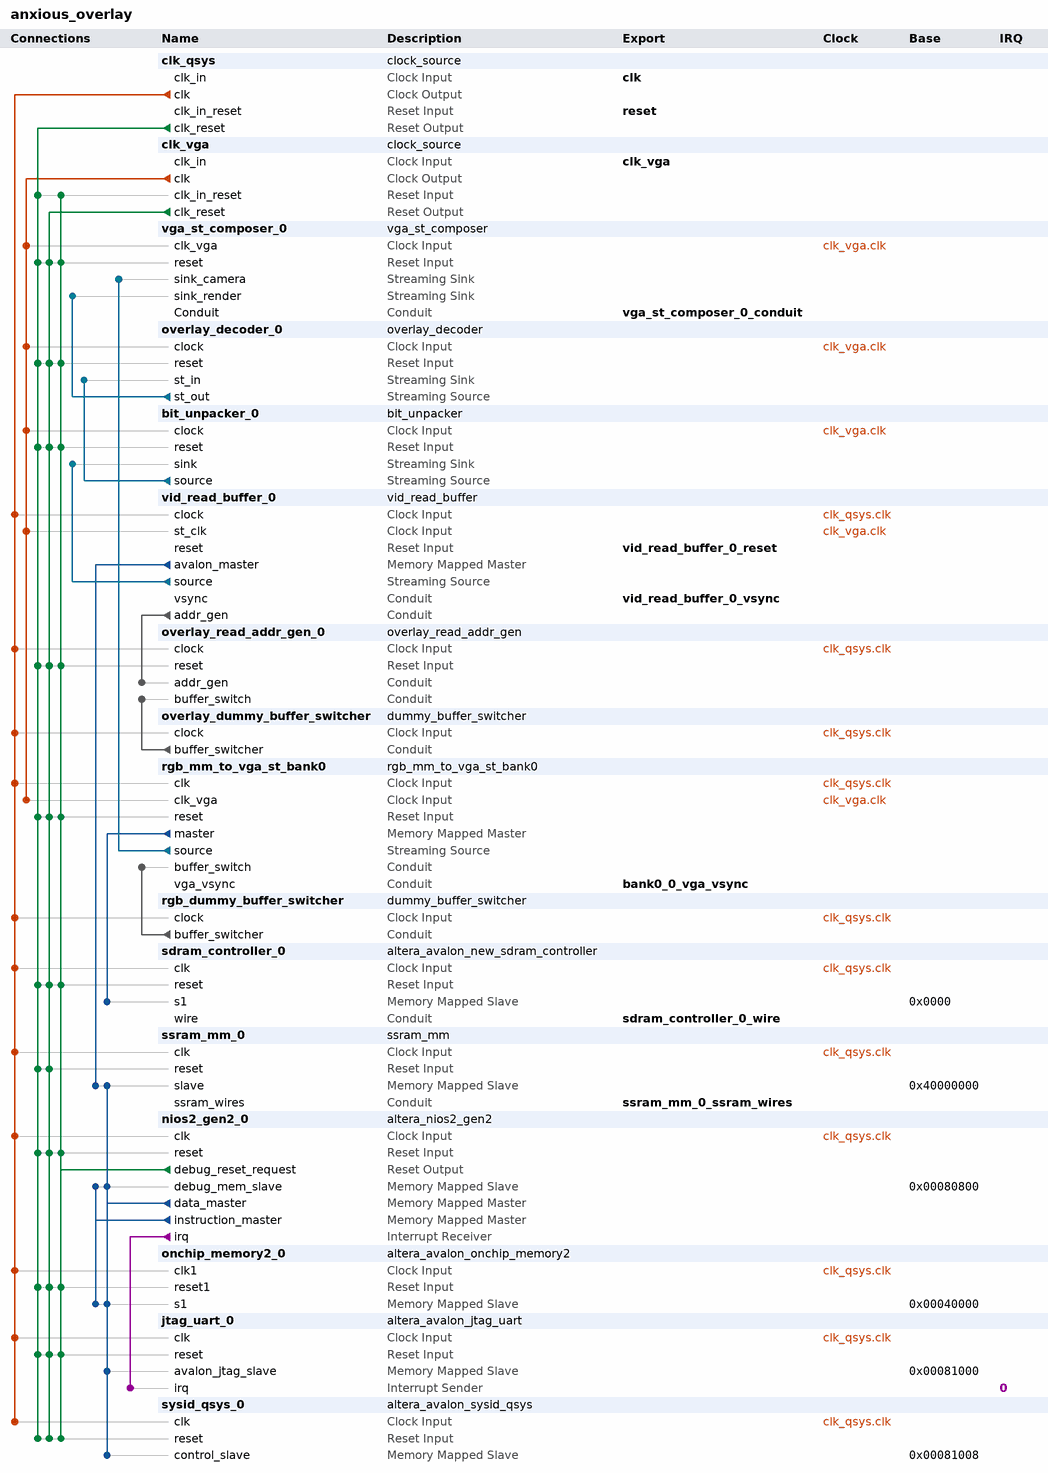
[diagram p0: system contents]
# Platform Designer (Qsys) system anxious_overlay, Cyclone IV GX EP4CGX150DF31C7
# Parameters at their usual value, and those the tool derives, are not listed.
package require -exact qsys 15.0
create_system anxious_overlay
set_project_property DEVICE_FAMILY {Cyclone IV GX}
set_project_property DEVICE EP4CGX150DF31C7

add_instance clk_qsys clock_source 15.0
set_instance_parameter_value clk_qsys clockFrequency 100000000

add_instance clk_vga clock_source 15.0
set_instance_parameter_value clk_vga clockFrequency 25000000

add_instance vga_st_composer_0 vga_st_composer 1.0
set_instance_parameter_value vga_st_composer_0 DATA_WIDTH 32
set_instance_parameter_value vga_st_composer_0 FIFO_LENGTH_LOG_2 6

add_instance overlay_decoder_0 overlay_decoder 1.0

add_instance bit_unpacker_0 bit_unpacker 1.0
set_instance_parameter_value bit_unpacker_0 DIN_WIDTH 8
set_instance_parameter_value bit_unpacker_0 DOUT_WIDTH 4

add_instance vid_read_buffer_0 vid_read_buffer 1.0
set_instance_parameter_value vid_read_buffer_0 ADDR_WIDTH 32
set_instance_parameter_value vid_read_buffer_0 DATA_WIDTH 8
set_instance_parameter_value vid_read_buffer_0 FIFO_LENGTH_LOG_2 6

add_instance overlay_read_addr_gen_0 overlay_read_addr_gen 1.0
set_instance_parameter_value overlay_read_addr_gen_0 ADDR_BASE 1073741824
set_instance_parameter_value overlay_read_addr_gen_0 ADDR_WIDTH 32
set_instance_parameter_value overlay_read_addr_gen_0 HEIGHT 480
set_instance_parameter_value overlay_read_addr_gen_0 WIDTH 640

add_instance overlay_dummy_buffer_switcher dummy_buffer_switcher 1.0
set_instance_parameter_value overlay_dummy_buffer_switcher FIXED_BUFFER_PORT 0

add_instance rgb_mm_to_vga_st_bank0 rgb_mm_to_vga_st_bank0 1.0

add_instance rgb_dummy_buffer_switcher dummy_buffer_switcher 1.0
set_instance_parameter_value rgb_dummy_buffer_switcher FIXED_BUFFER_PORT 0

add_instance sdram_controller_0 altera_avalon_new_sdram_controller 15.0
set_instance_parameter_value sdram_controller_0 TAC 5.5
set_instance_parameter_value sdram_controller_0 TRCD 20.0
set_instance_parameter_value sdram_controller_0 TRP 20.0
set_instance_parameter_value sdram_controller_0 casLatency 3
set_instance_parameter_value sdram_controller_0 columnWidth 10
set_instance_parameter_value sdram_controller_0 dataWidth 32
set_instance_parameter_value sdram_controller_0 generateSimulationModel false
set_instance_parameter_value sdram_controller_0 initRefreshCommands 8
set_instance_parameter_value sdram_controller_0 model single_Micron_MT48LC4M32B2_7_chip
set_instance_parameter_value sdram_controller_0 numberOfBanks 4
set_instance_parameter_value sdram_controller_0 numberOfChipSelects 1
set_instance_parameter_value sdram_controller_0 powerUpDelay 100.0
set_instance_parameter_value sdram_controller_0 refreshPeriod 7.8125
set_instance_parameter_value sdram_controller_0 rowWidth 13

add_instance ssram_mm_0 ssram_mm 1.0

add_instance nios2_gen2_0 altera_nios2_gen2 15.0
set_instance_parameter_value nios2_gen2_0 dcache_size 2048
set_instance_parameter_value nios2_gen2_0 exceptionSlave onchip_memory2_0.s1
set_instance_parameter_value nios2_gen2_0 icache_size 4096
set_instance_parameter_value nios2_gen2_0 impl Fast
set_instance_parameter_value nios2_gen2_0 resetSlave onchip_memory2_0.s1

add_instance onchip_memory2_0 altera_avalon_onchip_memory2 15.0
set_instance_parameter_value onchip_memory2_0 dataWidth 32
set_instance_parameter_value onchip_memory2_0 dualPort false
set_instance_parameter_value onchip_memory2_0 initMemContent true
set_instance_parameter_value onchip_memory2_0 initializationFileName onchip_mem.hex
set_instance_parameter_value onchip_memory2_0 memorySize 204800

add_instance jtag_uart_0 altera_avalon_jtag_uart 15.0
set_instance_parameter_value jtag_uart_0 simInteractiveOptions NO_INTERACTIVE_WINDOWS

add_instance sysid_qsys_0 altera_avalon_sysid_qsys 15.0
set_instance_parameter_value sysid_qsys_0 id 0

# connections
add_connection clk_qsys.clk jtag_uart_0.clk clock
add_connection clk_qsys.clk nios2_gen2_0.clk clock
add_connection clk_qsys.clk onchip_memory2_0.clk1 clock
add_connection clk_qsys.clk overlay_dummy_buffer_switcher.clock clock
add_connection clk_qsys.clk overlay_read_addr_gen_0.clock clock
add_connection clk_qsys.clk rgb_dummy_buffer_switcher.clock clock
add_connection clk_qsys.clk rgb_mm_to_vga_st_bank0.clk clock
add_connection clk_qsys.clk sdram_controller_0.clk clock
add_connection clk_qsys.clk ssram_mm_0.clk clock
add_connection clk_qsys.clk sysid_qsys_0.clk clock
add_connection clk_qsys.clk vid_read_buffer_0.clock clock
add_connection clk_vga.clk bit_unpacker_0.clock clock
add_connection clk_vga.clk overlay_decoder_0.clock clock
add_connection clk_vga.clk rgb_mm_to_vga_st_bank0.clk_vga clock
add_connection clk_vga.clk vga_st_composer_0.clk_vga clock
add_connection clk_vga.clk vid_read_buffer_0.st_clk clock
add_connection clk_qsys.clk_reset bit_unpacker_0.reset reset
add_connection clk_qsys.clk_reset clk_vga.clk_in_reset reset
add_connection clk_qsys.clk_reset jtag_uart_0.reset reset
add_connection clk_qsys.clk_reset nios2_gen2_0.reset reset
add_connection clk_qsys.clk_reset onchip_memory2_0.reset1 reset
add_connection clk_qsys.clk_reset overlay_decoder_0.reset reset
add_connection clk_qsys.clk_reset overlay_read_addr_gen_0.reset reset
add_connection clk_qsys.clk_reset rgb_mm_to_vga_st_bank0.reset reset
add_connection clk_qsys.clk_reset sdram_controller_0.reset reset
add_connection clk_qsys.clk_reset ssram_mm_0.reset reset
add_connection clk_qsys.clk_reset sysid_qsys_0.reset reset
add_connection clk_qsys.clk_reset vga_st_composer_0.reset reset
add_connection clk_vga.clk_reset bit_unpacker_0.reset reset
add_connection clk_vga.clk_reset jtag_uart_0.reset reset
add_connection clk_vga.clk_reset nios2_gen2_0.reset reset
add_connection clk_vga.clk_reset onchip_memory2_0.reset1 reset
add_connection clk_vga.clk_reset overlay_decoder_0.reset reset
add_connection clk_vga.clk_reset overlay_read_addr_gen_0.reset reset
add_connection clk_vga.clk_reset rgb_mm_to_vga_st_bank0.reset reset
add_connection clk_vga.clk_reset sdram_controller_0.reset reset
add_connection clk_vga.clk_reset ssram_mm_0.reset reset
add_connection clk_vga.clk_reset sysid_qsys_0.reset reset
add_connection clk_vga.clk_reset vga_st_composer_0.reset reset
add_connection nios2_gen2_0.debug_reset_request bit_unpacker_0.reset reset
add_connection nios2_gen2_0.debug_reset_request clk_vga.clk_in_reset reset
add_connection nios2_gen2_0.debug_reset_request jtag_uart_0.reset reset
add_connection nios2_gen2_0.debug_reset_request nios2_gen2_0.reset reset
add_connection nios2_gen2_0.debug_reset_request onchip_memory2_0.reset1 reset
add_connection nios2_gen2_0.debug_reset_request overlay_decoder_0.reset reset
add_connection nios2_gen2_0.debug_reset_request overlay_read_addr_gen_0.reset reset
add_connection nios2_gen2_0.debug_reset_request rgb_mm_to_vga_st_bank0.reset reset
add_connection nios2_gen2_0.debug_reset_request sdram_controller_0.reset reset
add_connection nios2_gen2_0.debug_reset_request sysid_qsys_0.reset reset
add_connection nios2_gen2_0.debug_reset_request vga_st_composer_0.reset reset
add_connection nios2_gen2_0.data_master jtag_uart_0.avalon_jtag_slave avalon
set_connection_parameter_value nios2_gen2_0.data_master/jtag_uart_0.avalon_jtag_slave baseAddress 0x00081000
add_connection nios2_gen2_0.data_master nios2_gen2_0.debug_mem_slave avalon
set_connection_parameter_value nios2_gen2_0.data_master/nios2_gen2_0.debug_mem_slave baseAddress 0x00080800
add_connection nios2_gen2_0.data_master onchip_memory2_0.s1 avalon
set_connection_parameter_value nios2_gen2_0.data_master/onchip_memory2_0.s1 baseAddress 0x00040000
add_connection nios2_gen2_0.data_master ssram_mm_0.slave avalon
set_connection_parameter_value nios2_gen2_0.data_master/ssram_mm_0.slave baseAddress 0x40000000
add_connection nios2_gen2_0.data_master sysid_qsys_0.control_slave avalon
set_connection_parameter_value nios2_gen2_0.data_master/sysid_qsys_0.control_slave baseAddress 0x00081008
add_connection nios2_gen2_0.instruction_master nios2_gen2_0.debug_mem_slave avalon
set_connection_parameter_value nios2_gen2_0.instruction_master/nios2_gen2_0.debug_mem_slave baseAddress 0x00080800
add_connection nios2_gen2_0.instruction_master onchip_memory2_0.s1 avalon
set_connection_parameter_value nios2_gen2_0.instruction_master/onchip_memory2_0.s1 baseAddress 0x00040000
add_connection rgb_mm_to_vga_st_bank0.master sdram_controller_0.s1 avalon
set_connection_parameter_value rgb_mm_to_vga_st_bank0.master/sdram_controller_0.s1 baseAddress 0x0000
add_connection vid_read_buffer_0.avalon_master ssram_mm_0.slave avalon
set_connection_parameter_value vid_read_buffer_0.avalon_master/ssram_mm_0.slave baseAddress 0x40000000
add_connection bit_unpacker_0.source overlay_decoder_0.st_in avalon_streaming
add_connection overlay_decoder_0.st_out vga_st_composer_0.sink_render avalon_streaming
add_connection rgb_mm_to_vga_st_bank0.source vga_st_composer_0.sink_camera avalon_streaming
add_connection vid_read_buffer_0.source bit_unpacker_0.sink avalon_streaming
add_connection overlay_dummy_buffer_switcher.buffer_switcher overlay_read_addr_gen_0.buffer_switch conduit
add_connection rgb_dummy_buffer_switcher.buffer_switcher rgb_mm_to_vga_st_bank0.buffer_switch conduit
add_connection vid_read_buffer_0.addr_gen overlay_read_addr_gen_0.addr_gen conduit
add_connection nios2_gen2_0.irq jtag_uart_0.irq interrupt
set_connection_parameter_value nios2_gen2_0.irq/jtag_uart_0.irq irqNumber 0

# exported interfaces
add_interface bank0_0_vga_vsync conduit end
set_interface_property bank0_0_vga_vsync EXPORT_OF rgb_mm_to_vga_st_bank0.vga_vsync
add_interface clk clock sink
set_interface_property clk EXPORT_OF clk_qsys.clk_in
add_interface clk_vga clock sink
set_interface_property clk_vga EXPORT_OF clk_vga.clk_in
add_interface reset reset sink
set_interface_property reset EXPORT_OF clk_qsys.clk_in_reset
add_interface sdram_controller_0_wire conduit end
set_interface_property sdram_controller_0_wire EXPORT_OF sdram_controller_0.wire
add_interface ssram_mm_0_ssram_wires conduit end
set_interface_property ssram_mm_0_ssram_wires EXPORT_OF ssram_mm_0.ssram_wires
add_interface vga_st_composer_0_conduit conduit end
set_interface_property vga_st_composer_0_conduit EXPORT_OF vga_st_composer_0.Conduit
add_interface vid_read_buffer_0_reset reset sink
set_interface_property vid_read_buffer_0_reset EXPORT_OF vid_read_buffer_0.reset
add_interface vid_read_buffer_0_vsync conduit end
set_interface_property vid_read_buffer_0_vsync EXPORT_OF vid_read_buffer_0.vsync

set_interconnect_requirement {$system} qsys_mm.clockCrossingAdapter HANDSHAKE
set_interconnect_requirement {$system} qsys_mm.enableEccProtection FALSE
set_interconnect_requirement {$system} qsys_mm.insertDefaultSlave FALSE
set_interconnect_requirement {$system} qsys_mm.maxAdditionalLatency 1

save_system anxious_overlay.qsys
